# Altium schematic sheet Sheet1.SchDoc
size A4; SheetNumber: 1; SheetTotal: 4
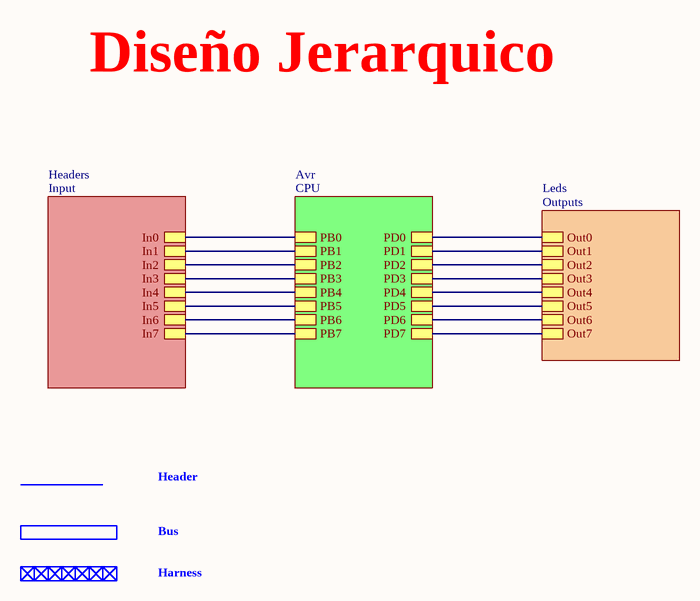
[diagram p0: Sheet1.SchDoc]

## Sub-sheets
Avr = CPU: PB0, PB1, PB2, PB3, PB4, PB5, PB6, PB7, PD0, PD1, PD2, PD3, PD4, PD5, PD6, PD7
Headers = Input: In0, In1, In2, In3, In4, In5, In6, In7
Leds = Outputs: Out0, Out1, Out2, Out3, Out4, Out5, Out6, Out7

## Nets
(unnamed): sheet Headers/In0, sheet Avr/PB0
(unnamed): sheet Headers/In1, sheet Avr/PB1
(unnamed): sheet Headers/In2, sheet Avr/PB2
(unnamed): sheet Headers/In3, sheet Avr/PB3
(unnamed): sheet Headers/In4, sheet Avr/PB4
(unnamed): sheet Headers/In5, sheet Avr/PB5
(unnamed): sheet Headers/In6, sheet Avr/PB6
(unnamed): sheet Headers/In7, sheet Avr/PB7
(unnamed): sheet Avr/PD0, sheet Leds/Out0
(unnamed): sheet Avr/PD1, sheet Leds/Out1
(unnamed): sheet Avr/PD2, sheet Leds/Out2
(unnamed): sheet Avr/PD3, sheet Leds/Out3
(unnamed): sheet Avr/PD4, sheet Leds/Out4
(unnamed): sheet Avr/PD5, sheet Leds/Out5
(unnamed): sheet Avr/PD6, sheet Leds/Out6
(unnamed): sheet Avr/PD7, sheet Leds/Out7

## Notes on the sheet
- Diseño Jerarquico
- Header
- Bus
- Harness